# Altium project Interposer.PrjPcb
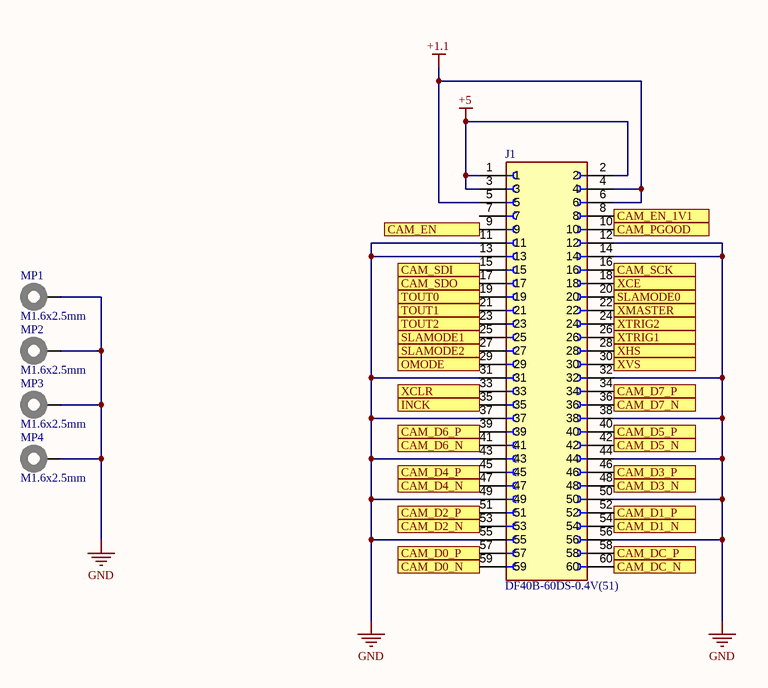
[diagram p0: CameraConn.SchDoc]
5 sheets, 48 parts. Net scope: flat (ports and power ports of the same name join across sheets).
Board file: PCB_Right.PcbDoc
Sheets:
  CameraConn.SchDoc
  CameraSupplies.SchDoc
  DisplayConn.SchDoc
  DisplaySupplies.SchDoc
  MainboardConn.SchDoc

## Sheet CameraConn.SchDoc
size 431 x 279 mm; Organization: ORGANIZATION; Address1: ADDRESS 1; Address2: ADDRESS 2; Address3: ADDRESS 3; Address4: ADDRESS 4; Revision: -; SheetNumber: 1; SheetTotal: 5; ENG_APP_DATE: --/--/--; DSN_APP_DATE: --/--/--; CHK_APP_DATE: --/--/--

### Parts
J1  DF40B-60DS-0.4V(51)  [HRS_DF40B-60DS-0.4V(51)]
MP1  M1.6x2.5mm  [97730256330]
MP2  M1.6x2.5mm  [97730256330]
MP3  M1.6x2.5mm  [97730256330]
MP4  M1.6x2.5mm  [97730256330]

### Ports
CAM_D0_N, CAM_D0_P, CAM_D1_N, CAM_D1_P, CAM_D2_N, CAM_D2_P, CAM_D3_N, CAM_D3_P, CAM_D4_N, CAM_D4_P, CAM_D5_N, CAM_D5_P, CAM_D6_N, CAM_D6_P, CAM_D7_N, CAM_D7_P, CAM_DC_N, CAM_DC_P, CAM_EN, CAM_EN_1V1, CAM_PGOOD, CAM_SCK, CAM_SDI, CAM_SDO, INCK, OMODE, SLAMODE0, SLAMODE1, SLAMODE2, TOUT0, TOUT1, TOUT2, XCE, XCLR, XHS, XMASTER, XTRIG1, XTRIG2, XVS

### Nets
+1.1: J1.4 J1.5 J1.6
+5: J1.1 J1.2 J1.3
GND: J1.11 J1.12 J1.13 J1.14 J1.31 J1.32 J1.37 J1.38 J1.43 J1.44 J1.49 J1.50 J1.55 J1.56 MP1.1 MP2.1 MP3.1 MP4.1
CAM_D0_N: J1.59 ; port CAM_D0_N
CAM_D0_P: J1.57 ; port CAM_D0_P
CAM_D1_N: J1.54 ; port CAM_D1_N
CAM_D1_P: J1.52 ; port CAM_D1_P
CAM_D2_N: J1.53 ; port CAM_D2_N
CAM_D2_P: J1.51 ; port CAM_D2_P
CAM_D3_N: J1.48 ; port CAM_D3_N
CAM_D3_P: J1.46 ; port CAM_D3_P
CAM_D4_N: J1.47 ; port CAM_D4_N
CAM_D4_P: J1.45 ; port CAM_D4_P
CAM_D5_N: J1.42 ; port CAM_D5_N
CAM_D5_P: J1.40 ; port CAM_D5_P
CAM_D6_N: J1.41 ; port CAM_D6_N
CAM_D6_P: J1.39 ; port CAM_D6_P
CAM_D7_N: J1.36 ; port CAM_D7_N
CAM_D7_P: J1.34 ; port CAM_D7_P
CAM_DC_N: J1.60 ; port CAM_DC_N
CAM_DC_P: J1.58 ; port CAM_DC_P
CAM_EN: J1.9 ; port CAM_EN
CAM_EN_1V1: J1.8 ; port CAM_EN_1V1
CAM_PGOOD: J1.10 ; port CAM_PGOOD
CAM_SCK: J1.16 ; port CAM_SCK
CAM_SDI: J1.15 ; port CAM_SDI
CAM_SDO: J1.17 ; port CAM_SDO
INCK: J1.35 ; port INCK
OMODE: J1.29 ; port OMODE
SLAMODE0: J1.20 ; port SLAMODE0
SLAMODE1: J1.25 ; port SLAMODE1
SLAMODE2: J1.27 ; port SLAMODE2
TOUT0: J1.19 ; port TOUT0
TOUT1: J1.21 ; port TOUT1
TOUT2: J1.23 ; port TOUT2
XCE: J1.18 ; port XCE
XCLR: J1.33 ; port XCLR
XHS: J1.28 ; port XHS
XMASTER: J1.22 ; port XMASTER
XTRIG1: J1.26 ; port XTRIG1
XTRIG2: J1.24 ; port XTRIG2
XVS: J1.30 ; port XVS

Not connected (* = marked no-connect by the designer): J1 7

### Notes on the sheet
- DWG. NO.
- REV.
- SHT.
- REVISION
- DESCRIPTION
- DATE
- APPROVED
- ENG:
- APPROVALS
- PROJECT
- DSN:
- CHK:
- REFERENCE DOCUMENTS
- PROJECT REVISION:
- TITLE
- SimulaVR
- DOCUMENT REVISION:
- DESIGN ITEM:
- BOM:
- FAB DWG:
- PCB DWG:
- ASSY DWG:
- SCALE:
- SIZE
- B
- CAGE CODE
- FILE NAME
- DWG NO.
- SHEET
- OF
- REV

### Library data of the parts
J1 = CMP-013-000000-1: MF: {'manufacturer': u'Hirose Electric Co Ltd'}; Availability: Unavailable; Package: None; Price: None; Source: DF40B-60DS-0.4V(51).SchLib; Value: *; Design Item ID: DF40B-60DS-0.4V(51); MP: DF40B-60DS-0.4V(51)
MP1-MP4 = 97730256330: WA-SMSI SMT Steel Spacer, internal Thread Bottom closed, OD 3.3mm, M1.6x2.5mm; Manufacturer: Wurth Elektronik; Inner Thread Length: 1.5mm; Surface: Tin; Thread: M1.6; ComponentLink1Description: Manufacturer; ComponentLink1URL: http://www.we-online.de; ComponentLink2Description: Datasheet; ComponentLink2URL: https://www.we-online.com/catalog/datasheet/97730256330.pdf; Mounting Technology: SMT; Packaging: Bulk; Manufacturer Part Number: 97730256330; Inner Diameter: -; Length: 2.5mm; Operating Temperature: -55 to +150degC; Outer Diameter: 3.3mm; Published Date: April 2020; Material: Steel

## Sheet CameraSupplies.SchDoc
size 431 x 279 mm; Organization: ORGANIZATION; Address1: ADDRESS 1; Address2: ADDRESS 2; Address3: ADDRESS 3; Address4: ADDRESS 4; Revision: -; SheetNumber: 2; SheetTotal: 5; ENG_APP_DATE: --/--/--; DSN_APP_DATE: --/--/--; CHK_APP_DATE: --/--/--
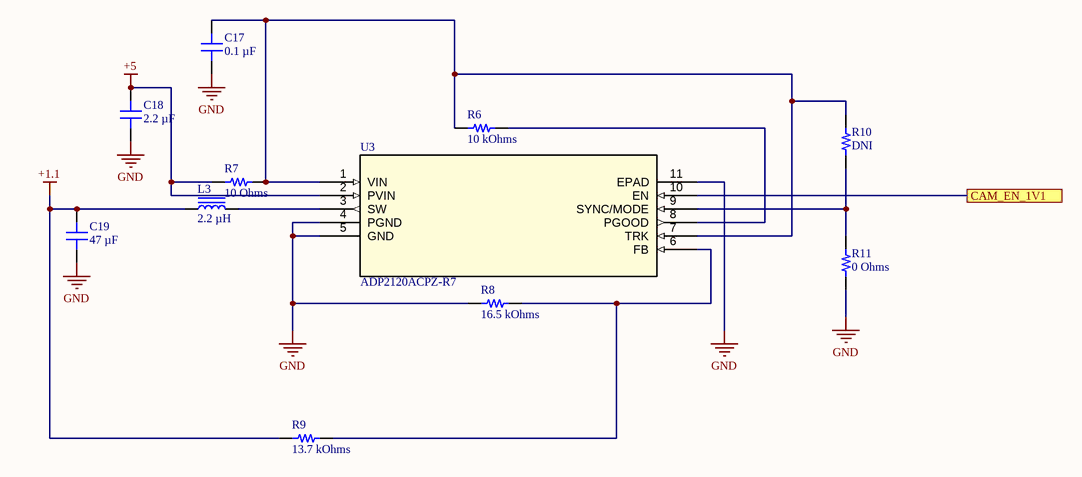
[diagram p1: CameraSupplies.SchDoc]

### Parts
C17  0.1 µF  [CAP 0201_0603]
C18  2.2 µF  [CAP 0402_1005]
C19  47 µF  [CAP 0603_1608]
L3  2.2 µH  [IND 0806_2016]
R6  10 kOhms  [RES 0201_0603]
R7  10 Ohms  [RES 0201_0603]
R8  16.5 kOhms  [RES 0201_0603]
R9  13.7 kOhms  [RES 0201_0603]
R10  DNI  [RES 0402_1005]
R11  0 Ohms  [RES 0402_1005]
U3  ADP2120ACPZ-R7  [CP_10_9_ADI]

### Ports
CAM_EN_1V1

### Nets
+1.1: C19.2 L3.1 R9.1
+5: C18.2 R7.1 U3.2(PVIN)
GND: C17.1 C18.1 C19.1 R8.1 R11.2 U3.4(PGND) U3.5(GND) U3.11(EPAD)
CAM_EN_1V1: U3.10(EN) ; port CAM_EN_1V1
NetC17_2: C17.2 R6.1 R7.2 R10.1 U3.1(VIN) U3.7(TRK)
NetL3_2: L3.2 U3.3(SW)
NetR6_2: R6.2 U3.8(PGOOD)
NetR8_2: R8.2 R9.2 U3.6(FB)
NetR10_2: R10.2 R11.1 U3.9(SYNC/MODE)

### Notes on the sheet
- DWG. NO.
- REV.
- SHT.
- REVISION
- DESCRIPTION
- DATE
- APPROVED
- ENG:
- APPROVALS
- PROJECT
- DSN:
- CHK:
- REFERENCE DOCUMENTS
- PROJECT REVISION:
- TITLE
- SimulaVR
- DOCUMENT REVISION:
- DESIGN ITEM:
- BOM:
- FAB DWG:
- PCB DWG:
- ASSY DWG:
- SCALE:
- SIZE
- B
- CAGE CODE
- FILE NAME
- DWG NO.
- SHEET
- OF
- REV

### Library data of the parts
C17 = GRM033R61A104KE15D: CAP CER 0.1UF 10V X5R 0201; manufacturer: Murata Electronics; Tolerance: ±10%; Part Number: GRM033R61A104KE15D; Value: 0.1 µF; Applications: General Purpose; Capacitance: 0.1 µF; componentlink1description: Datasheet; componentlink1url: https://www.murata.com/~/media/webrenewal/support/library/catalog/products/capacitor/mlcc/c02e.ashx?la=en-us; componentlink2description: DigiKey Link; componentlink2url: https://www.digikey.com/en/products/detail/murata-electronics/GRM033R61A104KE15D/2269163; Device Package: 0201 (0603 Metric); lastupdated: 2022-04-12 22:01:55; Lifecycle Status: Active; Minimum Order: 1; Mounting Type: Surface Mount, MLCC; Operating Temperature: -55°C ~ 85°C; Package / Case: 0201 (0603 Metric); packaging: CutTape; partid: 1641; Part Status: Active; price: 0.01; series: GRM; Size / Dimension: 0.024" L x 0.012" W (0.60mm x 0.30mm); Supplier 1: DigiKey; Supplier Part Number 1: 490-5881-1-ND; Temperature Coefficient: X5R; Thickness (Max): 0.013" (0.33mm); Voltage - Rated: 10V
C18 = GRM155R61C225ME44D: CAP CER 2.2UF 16V X5R 0402; manufacturer: Murata Electronics; Tolerance: ±20%; Part Number: GRM155R61C225ME44D; Value: 2.2 µF; Applications: General Purpose; Capacitance: 2.2 µF; componentlink1description: Datasheet; componentlink1url: https://search.murata.co.jp/Ceramy/image/img/A01X/G101/ENG/GRM155R61C225ME44-01.pdf; componentlink2description: DigiKey Link; componentlink2url: https://www.digikey.com/en/products/detail/murata-electronics/GRM155R61C225ME44D/5027541; Device Package: 0402 (1005 Metric); lastupdated: 2022-04-02 05:51:52; Lifecycle Status: Active; Minimum Order: 1; Mounting Type: Surface Mount, MLCC; Operating Temperature: -55°C ~ 85°C; Package / Case: 0402 (1005 Metric); packaging: TapeAndReel; partid: 4092; Part Status: Active; price: 0.03; series: GRM; Size / Dimension: 0.039" L x 0.020" W (1.00mm x 0.50mm); Supplier 1: DigiKey; Supplier Part Number 1: 490-10456-1-ND; Temperature Coefficient: X5R; Thickness (Max): 0.024" (0.60mm); Voltage - Rated: 16V
C19 = GRM188R60J476ME01D: CAP CER 47UF 6.3V X5R 0603; manufacturer: Murata Electronics; Tolerance: ±20%; Part Number: GRM188R60J476ME01D; Value: 47 µF; Applications: General Purpose; Capacitance: 47 µF; componentlink2description: DigiKey Link; componentlink2url: https://www.digikey.com/en/products/detail/murata-electronics/GRM188R60J476ME01D/13996874; Device Package: 0603 (1608 Metric); lastupdated: 5/20/2022 2:38:45 PM; Lifecycle Status: Active; Minimum Order: 1; Mounting Type: Surface Mount, MLCC; Operating Temperature: -55°C ~ 85°C; Package / Case: 0603 (1608 Metric); packaging: TapeAndReel; partid: 44498; Part Status: Active; price: 0.10; series: GRM; Size / Dimension: 0.063" L x 0.031" W (1.60mm x 0.80mm); Supplier 1: DigiKey; Supplier Part Number 1: 490-GRM188R60J476ME01DCT-ND; Temperature Coefficient: X5R; Thickness (Max): 0.039" (1.00mm); Voltage - Rated: 6.3V
L3 = 74479276222C: FIXED IND 2.2UH 1.6A 135MOHM SMD; Manufacturer: Würth Elektronik; Current - Saturation: 2.5A; DC Resistance (DCR): 135mOhm Max; Frequency - Self Resonant: 40MHz; Inductance Frequency - Test: 1 MHz; Material - Core: 0806 (2016 Metric); Shielding: Shielded; Tolerance: ±20%; Type: Molded; Part Number: 74479276222C; ComponentLink1Description: Datasheet; ComponentLink1URL: https://katalog.we-online.de/pbs/datasheet/74479276222C.pdf; ComponentLink2Description: DigiKey Link; ComponentLink2URL: https://www.digikey.com/en/products/detail/würth-elektronik/74479276222C/5870522; Current Rating (Amps): 1.6 A; Device Package: 0806 (2016 Metric); Height - Seated (Max): 0.039" (1.00mm); Inductance: 2.2 µH; LastUpdated: 5/23/2022 1:46:32 PM; Lifecycle Status: Active; Minimum Order: 1; Mounting Type: Surface Mount; Operating Temperature: -40°C ~ 125°C; Package / Case: 0806 (2016 Metric); Packaging: TapeAndReel; PartId: 2839; Part Status: Active; Price: 0.51; Series: WE-PMCI; Size / Dimension: 0.079" L x 0.063" W (2.00mm x 1.60mm); Supplier 1: DigiKey; Supplier Part Number 1: 732-9716-1-ND; Value: 2.2 µH
R6 = CRCW020110K0FKED: RES SMD 10K OHM 1% 1/20W 0201; Manufacturer: Vishay Dale; Power (Watts): 0.05W, 1/20W; Temperature Coefficient: ±100ppm/°C; Part Number: CRCW020110K0FKED; Value: 10 kOhms; ComponentLink1Description: Datasheet; ComponentLink1URL: http://www.vishay.com/docs/20052/crcw0201e3.pdf; ComponentLink2Description: DigiKey Link; ComponentLink2URL: https://www.digikey.com/en/products/detail/vishay-dale/CRCW020110K0FKED/1967989; Composition: Thick Film; Device Package: 0201 (0603 Metric); Height - Seated (Max): 0.010" (0.26mm); LastUpdated: 5/23/2022 1:02:37 PM; Lifecycle Status: Active; Minimum Order: 1; Number of Terminations: 2; Operating Temperature: -55°C ~ 155°C; Package / Case: 0201 (0603 Metric); Packaging: TapeAndReel; PartId: 29; Part Status: Active; Price: 0.03; Resistance: 10 kOhms; Series: CRCW; Size / Dimension: 0.024" L x 0.012" W (0.60mm x 0.30mm); Supplier 1: DigiKey; Supplier Part Number 1: 541-10.0KAABCT-ND; Supplier Device Package: 0201; Tolerance: ±1%
R7 = CRG0201F10R: RES SMD 10 OHM 1% 1/20W 0201; Manufacturer: TE Connectivity Passive Product; Power (Watts): 0.05W, 1/20W; Temperature Coefficient: ±400ppm/°C; Part Number: CRG0201F10R; Value: 10 Ohms; ComponentLink1Description: Datasheet; ComponentLink1URL: https://www.te.com/commerce/DocumentDelivery/DDEController?Action=srchrtrv&DocNm=1773204&DocType=DS&DocLang=English; ComponentLink2Description: DigiKey Link; ComponentLink2URL: https://www.digikey.com/en/products/detail/te-connectivity-passive-product/CRG0201F10R/4489648; Composition: Thick Film; Device Package: 0201 (0603 Metric); Height - Seated (Max): 0.010" (0.26mm); LastUpdated: 5/23/2022 1:02:37 PM; Lifecycle Status: Active; Minimum Order: 1; Number of Terminations: 2; Operating Temperature: -55°C ~ 155°C; Package / Case: 0201 (0603 Metric); Packaging: TapeAndReel; PartId: 3; Part Status: Active; Price: 0.03; Resistance: 10 Ohms; Series: CRG, Neohm; Size / Dimension: 0.024" L x 0.012" W (0.60mm x 0.30mm); Supplier 1: DigiKey; Supplier Part Number 1: A129573CT-ND; Supplier Device Package: 0201; Tolerance: ±1%
R8 = CRCW020116K5FNED: RES SMD 16.5K OHM 1% 1/20W 0201; Manufacturer: Vishay Dale; Power (Watts): 0.05W, 1/20W; Temperature Coefficient: ±200ppm/°C; Part Number: CRCW020116K5FNED; Value: 16.5 kOhms; ComponentLink1Description: Datasheet; ComponentLink1URL: http://www.vishay.com/docs/20052/crcw0201e3.pdf; ComponentLink2Description: DigiKey Link; ComponentLink2URL: https://www.digikey.com/en/products/detail/vishay-dale/CRCW020116K5FNED/1199935; Composition: Thick Film; Device Package: 0201 (0603 Metric); Height - Seated (Max): 0.011" (0.28mm); LastUpdated: 5/23/2022 1:02:31 PM; Lifecycle Status: Active; Minimum Order: 1; Number of Terminations: 2; Operating Temperature: -55°C ~ 155°C; Package / Case: 0201 (0603 Metric); Packaging: TapeAndReel; PartId: 1208; Part Status: Active; Price: 0.01; Resistance: 16.5 kOhms; Series: CRCW; Size / Dimension: 0.024" L x 0.012" W (0.60mm x 0.30mm); Supplier 1: DigiKey; Supplier Part Number 1: 541-CRCW020116K5FNEDCT-ND; Supplier Device Package: 0201; Tolerance: ±1%
R9 = RK73H1HTTC1372F: RES 13.7K OHM 1% 1/20W 0201; Manufacturer: KOA Speer Electronics, Inc.; Power (Watts): 0.05W, 1/20W; Temperature Coefficient: ±200ppm/°C; Part Number: RK73H1HTTC1372F; Value: 13.7 kOhms; ComponentLink1Description: Datasheet; ComponentLink1URL: http://www.koaspeer.com/catimages/Products/RK73H/RK73H.pdf; ComponentLink2Description: DigiKey Link; ComponentLink2URL: https://www.digikey.com/en/products/detail/koa-speer-electronics-inc/RK73H1HTTC1372F/9843939; Composition: Thick Film; Device Package: 0201 (0603 Metric); Features: Automotive AEC-Q200, Moisture Resistant; Height - Seated (Max): 0.010" (0.26mm); LastUpdated: 5/23/2022 1:02:37 PM; Lifecycle Status: Active; Minimum Order: 1; Number of Terminations: 2; Operating Temperature: -55°C ~ 155°C; Package / Case: 0201 (0603 Metric); Packaging: CutTape; PartId: 168; Part Status: Active; Price: 0.01; Ratings: AEC-Q200; Resistance: 13.7 kOhms; Series: RK73H; Size / Dimension: 0.024" L x 0.012" W (0.60mm x 0.30mm); Supplier 1: DigiKey; Supplier Part Number 1: 2019-RK73H1HTTC1372FCT-ND; Supplier Device Package: 0201; Tolerance: ±1%
R10 = CRCW04020000Z0EDHP: RES SMD 0 OHM JUMPER 1/5W 0402; Manufacturer: Vishay Dale; Power (Watts): 0.2W, 1/5W; Resistance: 0 Ohms; Part Number: CRCW04020000Z0EDHP; Value: DNI; ComponentLink1Description: Datasheet; ComponentLink1URL: http://www.vishay.com/docs/20043/crcwhpe3.pdf; ComponentLink2Description: DigiKey Link; ComponentLink2URL: http://digikey.com/product-detail/en/vishay-dale/CRCW04020000Z0EDHP/541-0.0YBCT-ND/2223008; Composition: Thick Film; Device Package: 0402 (1005 Metric); Features: Automotive AEC-Q200, Pulse Withstanding; Height - Seated (Max): 0.016" (0.40mm); LastUpdated: 2022-04-02 06:08:09; Lifecycle Status: Active; Minimum Order: 1; Number of Terminations: 2; Operating Temperature: -55°C ~ 155°C; Package / Case: 0402 (1005 Metric); Packaging: TapeAndReel; PartId: 3131; Part Status: Active; Price: 0.01; Ratings: AEC-Q200; Series: CRCW-HP; Size / Dimension: 0.039" L x 0.020" W (1.00mm x 0.50mm); Supplier 1: DigiKey; Supplier Part Number 1: 541-0.0YBCT-ND; Supplier Device Package: 0402; Tolerance: Jumper
R11 = CRCW04020000Z0EDHP: RES SMD 0 OHM JUMPER 1/5W 0402; Manufacturer: Vishay Dale; Power (Watts): 0.2W, 1/5W; Part Number: CRCW04020000Z0EDHP; Value: 0 Ohms; ComponentLink1Description: Datasheet; ComponentLink1URL: http://www.vishay.com/docs/20043/crcwhpe3.pdf; ComponentLink2Description: DigiKey Link; ComponentLink2URL: http://digikey.com/product-detail/en/vishay-dale/CRCW04020000Z0EDHP/541-0.0YBCT-ND/2223008; Composition: Thick Film; Device Package: 0402 (1005 Metric); Features: Automotive AEC-Q200, Pulse Withstanding; Height - Seated (Max): 0.016" (0.40mm); LastUpdated: 2022-04-02 06:08:09; Lifecycle Status: Active; Minimum Order: 1; Number of Terminations: 2; Operating Temperature: -55°C ~ 155°C; Package / Case: 0402 (1005 Metric); Packaging: TapeAndReel; PartId: 3131; Part Status: Active; Price: 0.01; Ratings: AEC-Q200; Resistance: 0 Ohms; Series: CRCW-HP; Size / Dimension: 0.039" L x 0.020" W (1.00mm x 0.50mm); Supplier 1: DigiKey; Supplier Part Number 1: 541-0.0YBCT-ND; Supplier Device Package: 0402; Tolerance: Jumper
U3 = CMP-011-000001-1: No Description Available; Mfr_Name: Analog Devices Inc; Source: ADP2120ACPZ-R7.SchLib; Design Item ID: ADP2120ACPZ-R7; RefDes: RefDes; Copyright: Copyright (C) 2022 Ultra Librarian. All rights reserved.; Manufacturer_Part_Number: ADP2120ACPZ-R7; Type: DEV

## Sheet DisplayConn.SchDoc
size 431 x 279 mm; Organization: ORGANIZATION; Address1: ADDRESS 1; Address2: ADDRESS 2; Address3: ADDRESS 3; Address4: ADDRESS 4; Revision: -; SheetNumber: 3; SheetTotal: 5; ENG_APP_DATE: --/--/--; DSN_APP_DATE: --/--/--; CHK_APP_DATE: --/--/--
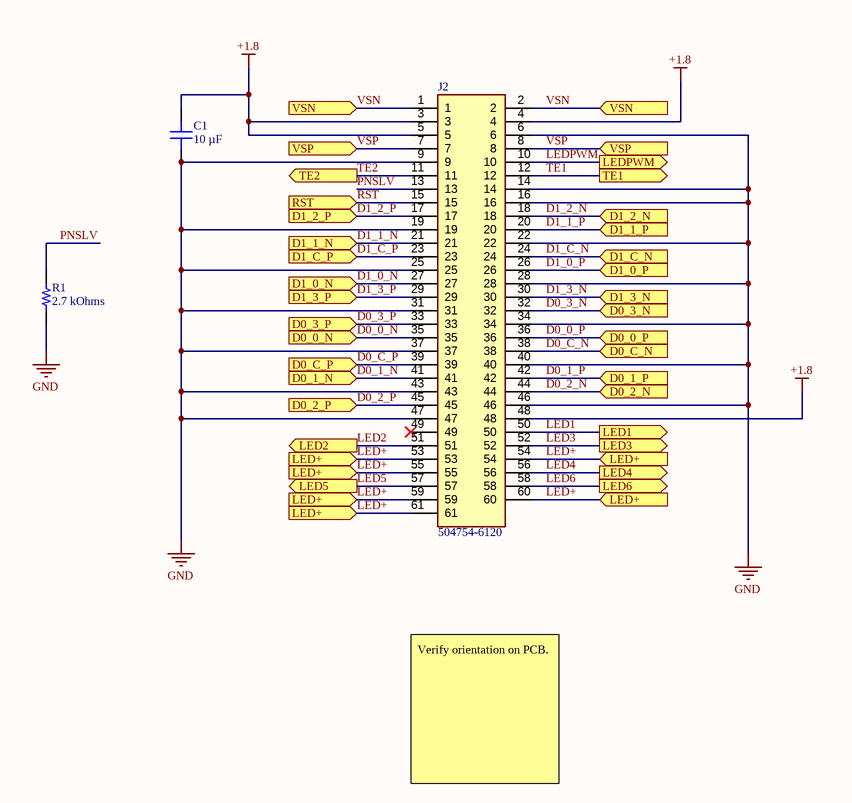
[diagram p2: DisplayConn.SchDoc]

### Parts
C1  10 µF  [CAP 0603_1608]
J2  504754-6120  [5047546120]
R1  2.7 kOhms  [RES 0201_0603]

### Ports
D0_0_N (in), D0_0_P (in), D0_1_N (in), D0_1_P (in), D0_2_N (in), D0_2_P (in), D0_3_N (in), D0_3_P (in), D0_C_N (in), D0_C_P (in), D1_0_N (in), D1_0_P (in), D1_1_N (in), D1_1_P (in), D1_2_N (in), D1_2_P (in), D1_3_N (in), D1_3_P (in), D1_C_N (in), D1_C_P (in), LED1 (out), LED2 (out), LED3 (out), LED4 (out), LED5 (out), LED6 (out), LED+ (in), LEDPWM (out), RST (in), TE1 (out), TE2 (out), VSN (in), VSP (in)

### Nets
+1.8: C1.2 J2.3 J2.4 J2.5 J2.48
GND: C1.1 J2.6 J2.9 J2.14 J2.16 J2.19 J2.22 J2.25 J2.28 J2.31 J2.34 J2.37 J2.40 J2.43 J2.46 J2.47 R1.1
D0_0_N: J2.35 ; port D0_0_N
D0_0_P: J2.36 ; port D0_0_P
D0_1_N: J2.41 ; port D0_1_N
D0_1_P: J2.42 ; port D0_1_P
D0_2_N: J2.44 ; port D0_2_N
D0_2_P: J2.45 ; port D0_2_P
D0_3_N: J2.32 ; port D0_3_N
D0_3_P: J2.33 ; port D0_3_P
D0_C_N: J2.38 ; port D0_C_N
D0_C_P: J2.39 ; port D0_C_P
D1_0_N: J2.27 ; port D1_0_N
D1_0_P: J2.26 ; port D1_0_P
D1_1_N: J2.21 ; port D1_1_N
D1_1_P: J2.20 ; port D1_1_P
D1_2_N: J2.18 ; port D1_2_N
D1_2_P: J2.17 ; port D1_2_P
D1_3_N: J2.30 ; port D1_3_N
D1_3_P: J2.29 ; port D1_3_P
D1_C_N: J2.24 ; port D1_C_N
D1_C_P: J2.23 ; port D1_C_P
LED1: J2.50 ; port LED1
LED2: J2.51 ; port LED2
LED3: J2.52 ; port LED3
LED4: J2.56 ; port LED4
LED5: J2.57 ; port LED5
LED6: J2.58 ; port LED6
LED+: J2.53 J2.54 J2.55 J2.59 J2.60 J2.61 ; port LED+
LEDPWM: J2.10 ; port LEDPWM
PNSLV: J2.13 R1.2
RST: J2.15 ; port RST
TE1: J2.12 ; port TE1
TE2: J2.11 ; port TE2
VSN: J2.1 J2.2 ; port VSN
VSP: J2.7 J2.8 ; port VSP

Not connected (* = marked no-connect by the designer): J2 49*

### Notes on the sheet
- Verify orientation on PCB.
- DWG. NO.
- REV.
- SHT.
- REVISION
- DESCRIPTION
- DATE
- APPROVED
- ENG:
- APPROVALS
- PROJECT
- DSN:
- CHK:
- REFERENCE DOCUMENTS
- PROJECT REVISION:
- TITLE
- SimulaVR
- DOCUMENT REVISION:
- DESIGN ITEM:
- BOM:
- FAB DWG:
- PCB DWG:
- ASSY DWG:
- SCALE:
- SIZE
- B
- CAGE CODE
- FILE NAME
- DWG NO.
- SHEET
- OF
- REV

### Library data of the parts
C1 = GRM188R61C106MA73D: CAP CER 10UF 16V X5R 0603; manufacturer: Murata Electronics; Tolerance: ±20%; Part Number: GRM188R61C106MA73D; Value: 10 µF; Applications: General Purpose; Capacitance: 10 µF; componentlink1description: Datasheet; componentlink1url: https://www.murata.com/~/media/webrenewal/support/library/catalog/products/capacitor/mlcc/c02e.ashx?la=en-us; componentlink2description: DigiKey Link; componentlink2url: https://www.digikey.com/en/products/detail/murata-electronics/GRM188R61C106MA73D/3900480; Device Package: 0603 (1608 Metric); lastupdated: 2022-04-02 05:55:00; Lifecycle Status: Active; Minimum Order: 1; Mounting Type: Surface Mount, MLCC; Operating Temperature: -55°C ~ 85°C; Package / Case: 0603 (1608 Metric); packaging: TapeAndReel; partid: 15141; Part Status: Active; price: 0.04; series: GRM; Size / Dimension: 0.063" L x 0.031" W (1.60mm x 0.80mm); Supplier 1: DigiKey; Supplier Part Number 1: 490-7201-1-ND; Temperature Coefficient: X5R; Thickness (Max): 0.039" (1.00mm); Voltage - Rated: 16V
J2 = 504754-6120: Connector; Manufacturer_Name: Molex; Datasheet Link: https://componentsearchengine.com/Datasheets/1/504754-6120.pdf; Height: 1.67mm; Manufacturer_Part_Number: 504754-6120; Mouser Part Number: 538-504754-6120; Mouser Price/Stock: https://www.mouser.com/Search/Refine.aspx?Keyword=538-504754-6120
R1 = ERJ-U01J272C: RES 2.7K OHM 5% 1/20W 0201 SMD; Manufacturer: Panasonic Electronic Components; Power (Watts): 0.05W, 1/20W; Temperature Coefficient: ±200ppm/°C; Part Number: ERJ-U01J272C; Value: 2.7 kOhms; ComponentLink1Description: Datasheet; ComponentLink1URL: https://industrial.panasonic.com/cdbs/www-data/pdf/RDP0000/AOA0000C334.pdf; ComponentLink2Description: DigiKey Link; ComponentLink2URL: https://www.digikey.com/en/products/detail/panasonic-electronic-components/ERJ-U01J272C/11641374; Composition: Thick Film; Device Package: 0201 (0603 Metric); Features: Anti-Sulfur; Height - Seated (Max): 0.010" (0.26mm); LastUpdated: 2022-04-12 22:15:26; Lifecycle Status: Active; Minimum Order: 1; Number of Terminations: 2; Operating Temperature: -55°C ~ 125°C; Package / Case: 0201 (0603 Metric); Packaging: TapeAndReel; PartId: 64645; Part Status: Active; Price: 0.04; Resistance: 2.7 kOhms; Series: ERJ-U01; Size / Dimension: 0.024" L x 0.012" W (0.60mm x 0.30mm); Supplier 1: DigiKey; Supplier Part Number 1: 10-ERJ-U01J272CCT-ND; Supplier Device Package: 0201; Tolerance: ±5%

## Sheet DisplaySupplies.SchDoc
size 431 x 279 mm; Organization: ORGANIZATION; Address1: ADDRESS 1; Address2: ADDRESS 2; Address3: ADDRESS 3; Address4: ADDRESS 4; Revision: -; SheetNumber: 4; SheetTotal: 5; ENG_APP_DATE: --/--/--; DSN_APP_DATE: --/--/--; CHK_APP_DATE: --/--/--
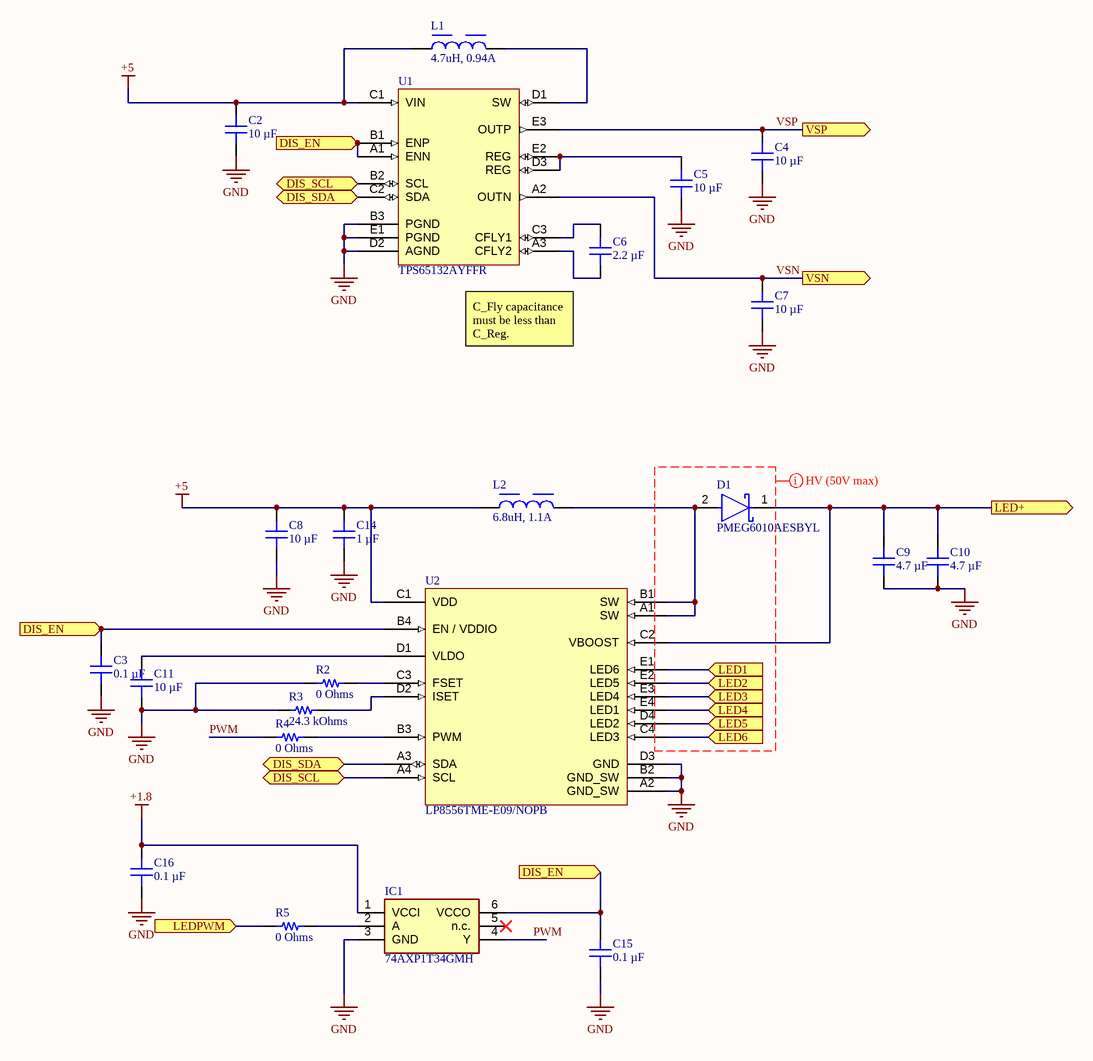
[diagram p3: DisplaySupplies.SchDoc]

### Parts
C2  10 µF  [CAP 0603_1608]
C3  0.1 µF  [CAP 0201_0603]
C4  10 µF  [CAP 0603_1608]
C5  10 µF  [CAP 0603_1608]
C6  2.2 µF  [CAP 0402_1005]
C7  10 µF  [CAP 0603_1608]
C8  10 µF  [CAP 0603_1608]
C9  4.7 µF  [CAP 1206_3216 - 0.8MM]
C10  4.7 µF  [CAP 1206_3216 - 0.8MM]
C11  10 µF  [CAP 0603_1608]
C14  1 µF  [CAP 0402_1005]
C15  0.1 µF  [CAP 0201_0603]
C16  0.1 µF  [CAP 0201_0603]
D1  PMEG6010AESBYL  [FP-SOD993-MFG]
IC1  74AXP1T34GMH  [PESD3V3L5UF115]
L1  4.7uH, 0.94A  [WE-MAPI_2510]
L2  6.8uH, 1.1A  [WE-MAPI_3015]
R2  0 Ohms  [RES 0402_1005]
R3  24.3 kOhms  [RES 0402_1005]
R4  0 Ohms  [RES 0402_1005]
R5  0 Ohms  [RES 0402_1005]
U1  TPS65132AYFFR  [BGA15C40P3X5_151X211X62]
U2  LP8556TME-E09/NOPB  [BGA20C40P4X5_171X237X68]

### Ports
DIS_EN (in), DIS_SCL (bidir), DIS_SDA (bidir), LED1 (in), LED2 (in), LED3 (in), LED4 (in), LED5 (in), LED6 (in), LED+ (out), LEDPWM (in), VSN (out), VSP (out)

### Nets
+1.8: C16.2 IC1.1(VCCI)
+5: C2.2 C8.2 C14.2 L1.1 L2.1 U1.C1(VIN) U2.C1(VDD)
GND: C2.1 C3.1 C4.1 C5.1 C7.1 C8.1 C9.1 C10.1 C11.1 C14.1 C15.1 C16.1 IC1.3(GND) R2.2 R3.2 U1.B3(PGND) U1.D2(AGND) U1.E1(PGND) U2.A2(GND_SW) U2.B2(GND_SW) U2.D3(GND)
DIS_EN: C3.2 C15.2 IC1.6(VCCO) U1.A1(ENN) U1.B1(ENP) U2.B4(EN_/_VDDIO) ; port DIS_EN
DIS_SCL: U1.B2(SCL) U2.A4(SCL) ; port DIS_SCL
DIS_SDA: U1.C2(SDA) U2.A3(SDA) ; port DIS_SDA
LED1: U2.E1(LED6) ; port LED1
LED2: U2.E2(LED5) ; port LED2
LED3: U2.E3(LED4) ; port LED3
LED4: U2.E4(LED1) ; port LED4
LED5: U2.D4(LED2) ; port LED5
LED6: U2.C4(LED3) ; port LED6
LED+: C9.2 C10.2 D1.1(K) U2.C2(VBOOST) ; port LED+
LEDPWM: R5.2 ; port LEDPWM
PWM: IC1.4(Y) R4.2
VSN: C7.2 U1.A2(OUTN) ; port VSN
VSP: C4.2 U1.E3(OUTP) ; port VSP
NetC5_2: C5.2 U1.D3(REG) U1.E2(REG)
NetC6_1: C6.1 U1.A3(CFLY2)
NetC6_2: C6.2 U1.C3(CFLY1)
NetC11_2: C11.2 U2.D1(VLDO)
NetD1_2: D1.2(A) L2.2 U2.A1(SW) U2.B1(SW)
NetIC1_2: IC1.2(A) R5.1
NetL1_2: L1.2 U1.D1(SW)
NetR2_1: R2.1 U2.C3(FSET)
NetR3_1: R3.1 U2.D2(ISET)
NetR4_1: R4.1 U2.B3(PWM)

Not connected (* = marked no-connect by the designer): IC1 5(n.c.)*

### Layout directives
net class HV: (no net found under the mark)

### Notes on the sheet
- C_Fly capacitance must be less than C_Reg.
- DWG. NO.
- REV.
- SHT.
- REVISION
- DESCRIPTION
- DATE
- APPROVED
- ENG:
- APPROVALS
- PROJECT
- DSN:
- CHK:
- REFERENCE DOCUMENTS
- PROJECT REVISION:
- TITLE
- SimulaVR
- DOCUMENT REVISION:
- DESIGN ITEM:
- BOM:
- FAB DWG:
- PCB DWG:
- ASSY DWG:
- SCALE:
- SIZE
- B
- CAGE CODE
- FILE NAME
- DWG NO.
- SHEET
- OF
- REV

### Library data of the parts
C2 C4 C5 C7 C8 C11 = GRM188R61C106MA73D: as C1 on sheet DisplayConn; Part Number: GRM188R61C106MA73D; Value: 10 µF; Applications: General Purpose; Capacitance: 10 µF; componentlink1description: Datasheet; componentlink1url: https://www.murata.com/~/media/webrenewal/support/library/catalog/products/capacitor/mlcc/c02e.ashx?la=en-us; componentlink2description: DigiKey Link; componentlink2url: https://www.digikey.com/en/products/detail/murata-electronics/GRM188R61C106MA73D/3900480; Device Package: 0603 (1608 Metric); lastupdated: 2022-04-02 05:55:00; Lifecycle Status: Active; Minimum Order: 1; Mounting Type: Surface Mount, MLCC; Operating Temperature: -55°C ~ 85°C; Package / Case: 0603 (1608 Metric); packaging: TapeAndReel; partid: 15141; Part Status: Active; price: 0.04; series: GRM; Size / Dimension: 0.063" L x 0.031" W (1.60mm x 0.80mm); Supplier 1: DigiKey; Supplier Part Number 1: 490-7201-1-ND; Temperature Coefficient: X5R; Thickness (Max): 0.039" (1.00mm); Voltage - Rated: 16V
C3 C15 C16 = GRM033R61A104KE15D: as C17 on sheet CameraSupplies; Part Number: GRM033R61A104KE15D; Value: 0.1 µF; Applications: General Purpose; Capacitance: 0.1 µF; componentlink1description: Datasheet; componentlink1url: https://www.murata.com/~/media/webrenewal/support/library/catalog/products/capacitor/mlcc/c02e.ashx?la=en-us; componentlink2description: DigiKey Link; componentlink2url: https://www.digikey.com/en/products/detail/murata-electronics/GRM033R61A104KE15D/2269163; Device Package: 0201 (0603 Metric); lastupdated: 2022-04-12 22:01:55; Lifecycle Status: Active; Minimum Order: 1; Mounting Type: Surface Mount, MLCC; Operating Temperature: -55°C ~ 85°C; Package / Case: 0201 (0603 Metric); packaging: CutTape; partid: 1641; Part Status: Active; price: 0.01; series: GRM; Size / Dimension: 0.024" L x 0.012" W (0.60mm x 0.30mm); Supplier 1: DigiKey; Supplier Part Number 1: 490-5881-1-ND; Temperature Coefficient: X5R; Thickness (Max): 0.013" (0.33mm); Voltage - Rated: 10V
C6 = GRM155R61C225ME44D: as C18 on sheet CameraSupplies; Part Number: GRM155R61C225ME44D; Value: 2.2 µF; Applications: General Purpose; Capacitance: 2.2 µF; componentlink1description: Datasheet; componentlink1url: https://search.murata.co.jp/Ceramy/image/img/A01X/G101/ENG/GRM155R61C225ME44-01.pdf; componentlink2description: DigiKey Link; componentlink2url: https://www.digikey.com/en/products/detail/murata-electronics/GRM155R61C225ME44D/5027541; Device Package: 0402 (1005 Metric); lastupdated: 2022-04-02 05:51:52; Lifecycle Status: Active; Minimum Order: 1; Mounting Type: Surface Mount, MLCC; Operating Temperature: -55°C ~ 85°C; Package / Case: 0402 (1005 Metric); packaging: TapeAndReel; partid: 4092; Part Status: Active; price: 0.03; series: GRM; Size / Dimension: 0.039" L x 0.020" W (1.00mm x 0.50mm); Supplier 1: DigiKey; Supplier Part Number 1: 490-10456-1-ND; Temperature Coefficient: X5R; Thickness (Max): 0.024" (0.60mm); Voltage - Rated: 16V
C9 C10 = GRM31CR71H475KA12L: CAP CER 4.7UF 50V X7R 1206; manufacturer: Murata Electronics; Tolerance: ±10%; Part Number: GRM31CR71H475KA12L; Value: 4.7 µF; Applications: General Purpose; Capacitance: 4.7 µF; componentlink1description: Datasheet; componentlink1url: https://www.murata.com/~/media/webrenewal/support/library/catalog/products/capacitor/mlcc/c02e.ashx?la=en-us; componentlink2description: DigiKey Link; componentlink2url: https://www.digikey.com/en/products/detail/murata-electronics/GRM31CR71H475KA12L/2548209; Device Package: 1206 (3216 Metric); lastupdated: 2022-04-02 06:00:47; Lifecycle Status: Active; Minimum Order: 1; Mounting Type: Surface Mount, MLCC; Operating Temperature: -55°C ~ 125°C; Package / Case: 1206 (3216 Metric); packaging: TapeAndReel; partid: 20010; Part Status: Active; price: 0.08; series: GRM; Size / Dimension: 0.126" L x 0.063" W (3.20mm x 1.60mm); Supplier 1: DigiKey; Supplier Part Number 1: 490-6521-1-ND; Temperature Coefficient: X7R; Thickness (Max): 0.071" (1.80mm); Voltage - Rated: 50V
C14 = GRM155R61C105MA12D: CAP CER 1UF 16V X5R 0402; manufacturer: Murata Electronics; Tolerance: ±20%; Part Number: GRM155R61C105MA12D; Value: 1 µF; Applications: General Purpose; Capacitance: 1 µF; componentlink1description: Datasheet; componentlink1url: https://search.murata.co.jp/Ceramy/image/img/A01X/G101/ENG/GRM155R61C105MA12-01.pdf; componentlink2description: DigiKey Link; componentlink2url: https://www.digikey.com/en/products/detail/murata-electronics/GRM155R61C105MA12D/4905131; Device Package: 0402 (1005 Metric); lastupdated: 2022-04-02 05:51:33; Lifecycle Status: Active; Minimum Order: 1; Mounting Type: Surface Mount, MLCC; Operating Temperature: -55°C ~ 85°C; Package / Case: 0402 (1005 Metric); packaging: TapeAndReel; partid: 10295; Part Status: Active; price: 0.01; series: GRM; Size / Dimension: 0.039" L x 0.020" W (1.00mm x 0.50mm); Supplier 1: DigiKey; Supplier Part Number 1: 490-14599-1-ND; Temperature Coefficient: X5R; Thickness (Max): 0.022" (0.55mm); Voltage - Rated: 16V
D1 = CMP-14398-000012-1: DIODE SCHOTTKY 60V 1A DSN1006-2
IC1 = 74AXP1T34GMH: Integrated Circuit; Manufacturer_Name: Nexperia; Datasheet Link: https://assets.nexperia.com/documents/data-sheet/74AXP1T34.pdf; Height: 0.5mm; Manufacturer_Part_Number: 74AXP1T34GMH; Mouser Part Number: 771-74AXP1T34GMH; Mouser Price/Stock: https://www.mouser.co.uk/ProductDetail/Nexperia/74AXP1T34GMH?qs=64Y9EYqwa9hz4MxtKQGkpQ%3D%3D; Arrow Part Number: 74AXP1T34GMH; Arrow Price/Stock: https://www.arrow.com/en/products/74axp1t34gmh/nexperia
L1 = 74438323047: WE-MAPI SMT Power Inductor, size 2510, 4.7uH, 0.94A; Manufacturer: Wurth Elektronik; DC Resistance typ.: 338mOhm; DC Resistance max.: 388mOhm; Self Resonant Frequency: 35MHz; Saturation Current: 1.75A; ComponentLink1Description: Manufacturer; ComponentLink1URL: http://www.we-online.de; ComponentLink2Description: Datasheet; ComponentLink2URL: https://www.we-online.com/catalog/datasheet/74438323047.pdf; Mounting Technology: SMT; Operating Temperature: -40 to +125degC; Packaging: Tape and Reel; Size: 2510; Inductance: 4.7uH; Manufacturer Part Number: 74438323047; Rated Current: 0.94A; Height: 1mm; Length: 2.5mm; Width: 2mm
L2 = 74438335068: WE-MAPI SMT Power Inductor, size 3015, 6.8uH, 1.1A; Manufacturer: Wurth Elektronik; DC Resistance typ.: 250mOhm; DC Resistance max.: 287mOhm; Self Resonant Frequency: 25MHz; Saturation Current: 2.4A; ComponentLink1Description: Manufacturer; ComponentLink1URL: http://www.we-online.de; ComponentLink2Description: Datasheet; ComponentLink2URL: https://www.we-online.com/catalog/datasheet/74438335068.pdf; Mounting Technology: SMT; Operating Temperature: -40 to +125degC; Packaging: Tape and Reel; Size: 3015; Inductance: 6.8uH; Manufacturer Part Number: 74438335068; Rated Current: 1.1A; Height: 1.5mm; Length: 3mm; Width: 3mm
R2 R4 R5 = CRCW04020000Z0EDHP: as R11 on sheet CameraSupplies; Part Number: CRCW04020000Z0EDHP; Value: 0 Ohms; ComponentLink1Description: Datasheet; ComponentLink1URL: http://www.vishay.com/docs/20043/crcwhpe3.pdf; ComponentLink2Description: DigiKey Link; ComponentLink2URL: http://digikey.com/product-detail/en/vishay-dale/CRCW04020000Z0EDHP/541-0.0YBCT-ND/2223008; Composition: Thick Film; Device Package: 0402 (1005 Metric); Features: Automotive AEC-Q200, Pulse Withstanding; Height - Seated (Max): 0.016" (0.40mm); LastUpdated: 2022-04-02 06:08:09; Lifecycle Status: Active; Minimum Order: 1; Number of Terminations: 2; Operating Temperature: -55°C ~ 155°C; Package / Case: 0402 (1005 Metric); Packaging: TapeAndReel; PartId: 3131; Part Status: Active; Price: 0.01; Ratings: AEC-Q200; Resistance: 0 Ohms; Series: CRCW-HP; Size / Dimension: 0.039" L x 0.020" W (1.00mm x 0.50mm); Supplier 1: DigiKey; Supplier Part Number 1: 541-0.0YBCT-ND; Supplier Device Package: 0402; Tolerance: Jumper
R3 = RC0402FR-0724K3L: RES 24.3K OHM 1% 1/16W 0402; Manufacturer: Yageo; Power (Watts): 0.063W, 1/16W; Temperature Coefficient: ±100ppm/°C; Part Number: RC0402FR-0724K3L; Value: 24.3 kOhms; ComponentLink1Description: Datasheet; ComponentLink1URL: https://www.yageo.com/upload/media/product/productsearch/datasheet/rchip/PYu-RC_Group_51_RoHS_L_10.pdf; ComponentLink2Description: DigiKey Link; ComponentLink2URL: https://www.digikey.com/en/products/detail/yageo/RC0402FR-0724K3L/5280931; Composition: Thick Film; Device Package: 0402 (1005 Metric); Features: Moisture Resistant; Height - Seated (Max): 0.016" (0.40mm); LastUpdated: 2022-04-02 06:08:10; Lifecycle Status: Active; Minimum Order: 1; Number of Terminations: 2; Operating Temperature: -55°C ~ 155°C; Package / Case: 0402 (1005 Metric); Packaging: CutTape; PartId: 2738; Part Status: Active; Price: 0.01; Resistance: 24.3 kOhms; Series: RC_L; Size / Dimension: 0.039" L x 0.020" W (1.00mm x 0.50mm); Supplier 1: DigiKey; Supplier Part Number 1: YAG3071CT-ND; Supplier Device Package: 0402; Tolerance: ±1%
U1 = CMP-019-00049-2: Split-Rail, Single Inductor Dual Output Converter with Positive and Negative Outputs 15-DSBGA -40 to 85
U2 = CMP-019-00051-2: 6 channel high-efficiency/Efficacy LED backlight driver 20-DSBGA -30 to 85

## Sheet MainboardConn.SchDoc
size 431 x 279 mm; Organization: ORGANIZATION; Address1: ADDRESS 1; Address2: ADDRESS 2; Address3: ADDRESS 3; Address4: ADDRESS 4; Revision: -; SheetNumber: 5; SheetTotal: 5; ENG_APP_DATE: --/--/--; DSN_APP_DATE: --/--/--; CHK_APP_DATE: --/--/--
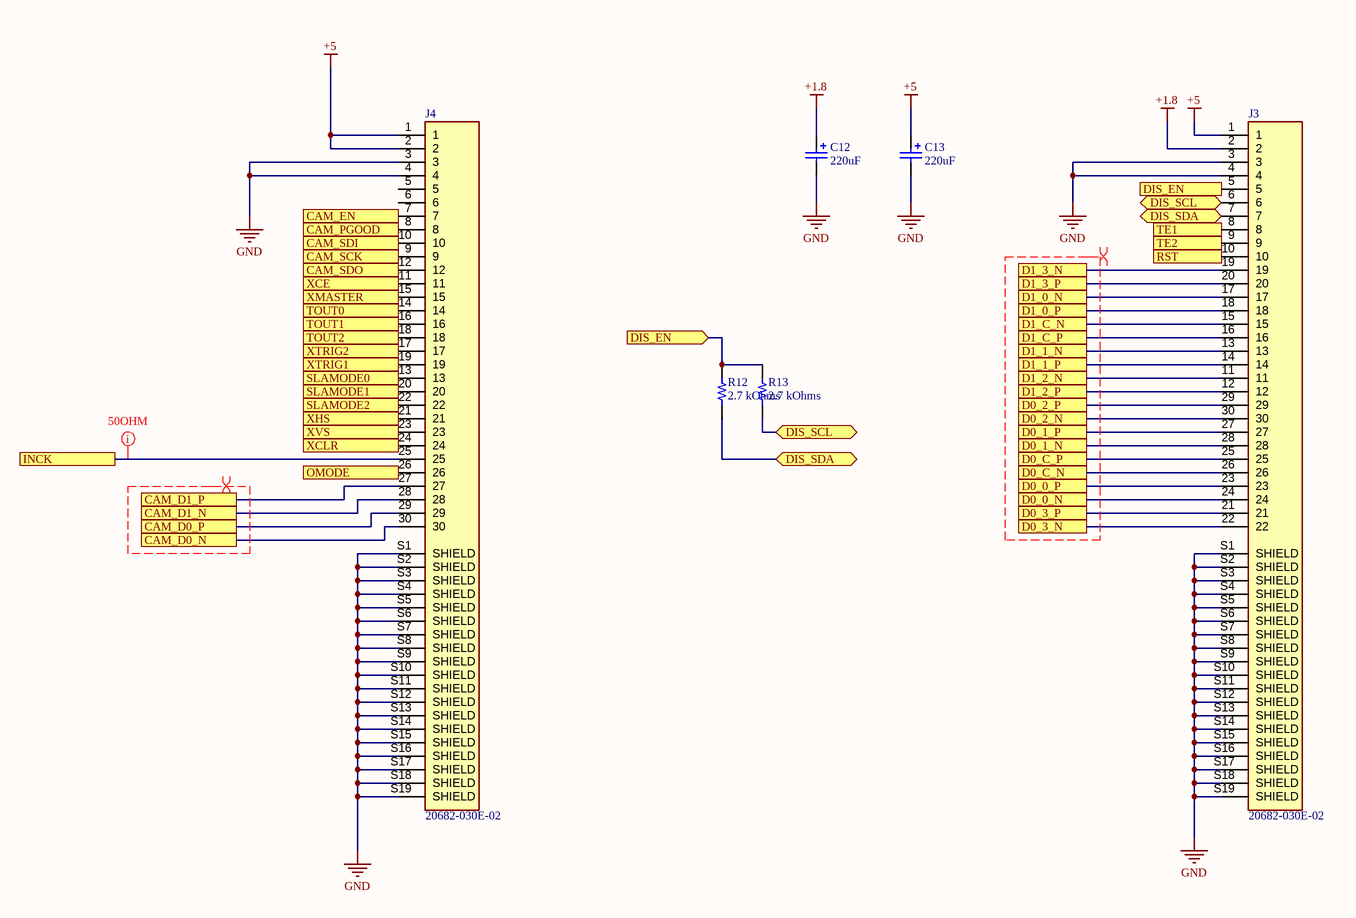
[diagram p4: MainboardConn.SchDoc]

### Parts
C12  220uF  [WCAP-PHGP_L7.3W4.3H1.9]
C13  220uF  [WCAP-PHGP_L7.3W4.3H1.9]
J3  20682-030E-02  [IPEX_20682-030E-02]
J4  20682-030E-02  [IPEX_20682-030E-02]
R12  2.7 kOhms  [RES 0201_0603]
R13  2.7 kOhms  [RES 0201_0603]

### Ports
CAM_D0_N, CAM_D0_P, CAM_D1_N, CAM_D1_P, CAM_EN, CAM_PGOOD, CAM_SCK, CAM_SDI, CAM_SDO, D0_0_N, D0_0_P, D0_1_N, D0_1_P, D0_2_N, D0_2_P, D0_3_N, D0_3_P, D0_C_N, D0_C_P, D1_0_N, D1_0_P, D1_1_N, D1_1_P, D1_2_N, D1_2_P, D1_3_N, D1_3_P, D1_C_N, D1_C_P, DIS_EN (in), DIS_SCL (bidir), DIS_SDA (bidir), INCK, OMODE, RST, SLAMODE0, SLAMODE1, SLAMODE2, TE1, TE2, TOUT0, TOUT1, TOUT2, XCE, XCLR, XHS, XMASTER, XTRIG1, XTRIG2, XVS

### Nets
+1.8: C12.1(P) J3.2
+5: C13.1(P) J3.1 J4.1 J4.2
GND: C12.2(N) C13.2(N) J3.3 J3.4 J3.S1(SHIELD) J3.S2(SHIELD) J3.S3(SHIELD) J3.S4(SHIELD) J3.S5(SHIELD) J3.S6(SHIELD) J3.S7(SHIELD) J3.S8(SHIELD) J3.S9(SHIELD) J3.S10(SHIELD) J3.S11(SHIELD) J3.S12(SHIELD) J3.S13(SHIELD) J3.S14(SHIELD) J3.S15(SHIELD) J3.S16(SHIELD) J3.S17(SHIELD) J3.S18(SHIELD) J3.S19(SHIELD) J4.3 J4.4 J4.S1(SHIELD) J4.S2(SHIELD) J4.S3(SHIELD) J4.S4(SHIELD) J4.S5(SHIELD) J4.S6(SHIELD) J4.S7(SHIELD) J4.S8(SHIELD) J4.S9(SHIELD) J4.S10(SHIELD) J4.S11(SHIELD) J4.S12(SHIELD) J4.S13(SHIELD) J4.S14(SHIELD) J4.S15(SHIELD) J4.S16(SHIELD) J4.S17(SHIELD) J4.S18(SHIELD) J4.S19(SHIELD)
CAM_D0_N: J4.30 ; port CAM_D0_N
CAM_D0_P: J4.29 ; port CAM_D0_P
CAM_D1_N: J4.28 ; port CAM_D1_N
CAM_D1_P: J4.27 ; port CAM_D1_P
CAM_EN: J4.7 ; port CAM_EN
CAM_PGOOD: J4.8 ; port CAM_PGOOD
CAM_SCK: J4.9 ; port CAM_SCK
CAM_SDI: J4.10 ; port CAM_SDI
CAM_SDO: J4.12 ; port CAM_SDO
D0_0_N: J3.24 ; port D0_0_N
D0_0_P: J3.23 ; port D0_0_P
D0_1_N: J3.28 ; port D0_1_N
D0_1_P: J3.27 ; port D0_1_P
D0_2_N: J3.30 ; port D0_2_N
D0_2_P: J3.29 ; port D0_2_P
D0_3_N: J3.22 ; port D0_3_N
D0_3_P: J3.21 ; port D0_3_P
D0_C_N: J3.26 ; port D0_C_N
D0_C_P: J3.25 ; port D0_C_P
D1_0_N: J3.17 ; port D1_0_N
D1_0_P: J3.18 ; port D1_0_P
D1_1_N: J3.13 ; port D1_1_N
D1_1_P: J3.14 ; port D1_1_P
D1_2_N: J3.11 ; port D1_2_N
D1_2_P: J3.12 ; port D1_2_P
D1_3_N: J3.19 ; port D1_3_N
D1_3_P: J3.20 ; port D1_3_P
D1_C_N: J3.15 ; port D1_C_N
D1_C_P: J3.16 ; port D1_C_P
DIS_EN: J3.5 R12.2 R13.2 ; port DIS_EN
DIS_SCL: J3.6 R13.1 ; port DIS_SCL
DIS_SDA: J3.7 R12.1 ; port DIS_SDA
INCK: J4.25 ; port INCK
OMODE: J4.26 ; port OMODE
RST: J3.10 ; port RST
SLAMODE0: J4.13 ; port SLAMODE0
SLAMODE1: J4.20 ; port SLAMODE1
SLAMODE2: J4.22 ; port SLAMODE2
TE1: J3.8 ; port TE1
TE2: J3.9 ; port TE2
TOUT0: J4.14 ; port TOUT0
TOUT1: J4.16 ; port TOUT1
TOUT2: J4.18 ; port TOUT2
XCE: J4.11 ; port XCE
XCLR: J4.24 ; port XCLR
XHS: J4.21 ; port XHS
XMASTER: J4.15 ; port XMASTER
XTRIG1: J4.19 ; port XTRIG1
XTRIG2: J4.17 ; port XTRIG2
XVS: J4.23 ; port XVS

Not connected (* = marked no-connect by the designer): J4 5 6

### Layout directives
differential pair; net class MIPI; differential pair class MIPI: (no net found under the mark)
differential pair; net class SLVS-EC; differential pair class SLVS-EC: (no net found under the mark)
net class 50OHM: INCK

### Notes on the sheet
- DWG. NO.
- REV.
- SHT.
- REVISION
- DESCRIPTION
- DATE
- APPROVED
- ENG:
- APPROVALS
- PROJECT
- DSN:
- CHK:
- REFERENCE DOCUMENTS
- PROJECT REVISION:
- TITLE
- SimulaVR
- DOCUMENT REVISION:
- DESIGN ITEM:
- BOM:
- FAB DWG:
- PCB DWG:
- ASSY DWG:
- SCALE:
- SIZE
- B
- CAGE CODE
- FILE NAME
- DWG NO.
- SHEET
- OF
- REV

### Library data of the parts
C12 C13 = 875015119006: WCAP-PHGP Aluminum Polymer Capacitor, H-Chip SMT, L7.3W4.3H1.9mm, 220uF, 6.3V; Manufacturer: Wurth Elektronik; Capacitance Tolerance: +/-20%; Dissipation Factor: 6%; Endurance: 2000h; ESR: 15mOhm; Leakage Current: 138.6uA; Ripple Current: 5100mA; Technical Reference: PSE2917221M6R3DHCT2HT19; ComponentLink1Description: Manufacturer Link; ComponentLink1URL: https://www.we-online.com/redexpert/article/875015119006?ad; ComponentLink2Description: Datasheet; ComponentLink2URL: https://www.we-online.com/redexpert/spec/875015119006?ad; Category: Aluminum Polymer Capacitors; Match Code: WCAP-PHGP; Manufacturer Part Number: 875015119006; Mount: Surface Mount; Operating Temperature Max: 105°C; Operating Temperature Min: -55°C; Packaging: Tape and Reel; Length: 7.3mm; Width: 4.3mm; Height: 1.9mm; Capacitance: 220uF; Rated Voltage (DC): 6.3V
J3 = 20682-030E-02: Cabline-CAII Rece. Ass'y; MF: {'manufacturer': u'I-PEX'}; Value: *; Availability: Unavailable; Price: None; Package: None; MP: 20682-030E-02
J4 = CMP-004-000000-1: Cabline-CAII Rece. Ass'y; MF: {'manufacturer': u'I-PEX'}; Availability: Unavailable; Price: None; MP: 20682-030E-02; Design Item ID: 20682-030E-02; Source: 20682-030E-02.SchLib; Package: None; Value: *
R12 R13 = ERJ-U01J272C: as R1 on sheet DisplayConn; Part Number: ERJ-U01J272C; Value: 2.7 kOhms; ComponentLink1Description: Datasheet; ComponentLink1URL: https://industrial.panasonic.com/cdbs/www-data/pdf/RDP0000/AOA0000C334.pdf; ComponentLink2Description: DigiKey Link; ComponentLink2URL: https://www.digikey.com/en/products/detail/panasonic-electronic-components/ERJ-U01J272C/11641374; Composition: Thick Film; Device Package: 0201 (0603 Metric); Features: Anti-Sulfur; Height - Seated (Max): 0.010" (0.26mm); LastUpdated: 2022-04-12 22:15:26; Lifecycle Status: Active; Minimum Order: 1; Number of Terminations: 2; Operating Temperature: -55°C ~ 125°C; Package / Case: 0201 (0603 Metric); Packaging: TapeAndReel; PartId: 64645; Part Status: Active; Price: 0.04; Resistance: 2.7 kOhms; Series: ERJ-U01; Size / Dimension: 0.024" L x 0.012" W (0.60mm x 0.30mm); Supplier 1: DigiKey; Supplier Part Number 1: 10-ERJ-U01J272CCT-ND; Supplier Device Package: 0201; Tolerance: ±5%

## Nets that join several sheets
+1.1: CameraConn (J1.4 J1.5 J1.6), CameraSupplies (C19.2 L3.1 R9.1)
+1.8: DisplayConn (5 pins), DisplaySupplies (C16.2 IC1.1), MainboardConn (C12.1 J3.2)
+5: CameraConn (J1.1 J1.2 J1.3), CameraSupplies (C18.2 R7.1 U3.2), DisplaySupplies (7 pins), MainboardConn (C13.1 J3.1 J4.1 J4.2)
GND: CameraConn (18 pins), CameraSupplies (8 pins), DisplayConn (17 pins), DisplaySupplies (21 pins), MainboardConn (44 pins)
CAM_D0_N: CameraConn (J1.59), MainboardConn (J4.30)
CAM_D0_P: CameraConn (J1.57), MainboardConn (J4.29)
CAM_D1_N: CameraConn (J1.54), MainboardConn (J4.28)
CAM_D1_P: CameraConn (J1.52), MainboardConn (J4.27)
CAM_EN: CameraConn (J1.9), MainboardConn (J4.7)
CAM_EN_1V1: CameraConn (J1.8), CameraSupplies (U3.10)
CAM_PGOOD: CameraConn (J1.10), MainboardConn (J4.8)
CAM_SCK: CameraConn (J1.16), MainboardConn (J4.9)
CAM_SDI: CameraConn (J1.15), MainboardConn (J4.10)
CAM_SDO: CameraConn (J1.17), MainboardConn (J4.12)
D0_0_N: DisplayConn (J2.35), MainboardConn (J3.24)
D0_0_P: DisplayConn (J2.36), MainboardConn (J3.23)
D0_1_N: DisplayConn (J2.41), MainboardConn (J3.28)
D0_1_P: DisplayConn (J2.42), MainboardConn (J3.27)
D0_2_N: DisplayConn (J2.44), MainboardConn (J3.30)
D0_2_P: DisplayConn (J2.45), MainboardConn (J3.29)
D0_3_N: DisplayConn (J2.32), MainboardConn (J3.22)
D0_3_P: DisplayConn (J2.33), MainboardConn (J3.21)
D0_C_N: DisplayConn (J2.38), MainboardConn (J3.26)
D0_C_P: DisplayConn (J2.39), MainboardConn (J3.25)
D1_0_N: DisplayConn (J2.27), MainboardConn (J3.17)
D1_0_P: DisplayConn (J2.26), MainboardConn (J3.18)
D1_1_N: DisplayConn (J2.21), MainboardConn (J3.13)
D1_1_P: DisplayConn (J2.20), MainboardConn (J3.14)
D1_2_N: DisplayConn (J2.18), MainboardConn (J3.11)
D1_2_P: DisplayConn (J2.17), MainboardConn (J3.12)
D1_3_N: DisplayConn (J2.30), MainboardConn (J3.19)
D1_3_P: DisplayConn (J2.29), MainboardConn (J3.20)
D1_C_N: DisplayConn (J2.24), MainboardConn (J3.15)
D1_C_P: DisplayConn (J2.23), MainboardConn (J3.16)
DIS_EN: DisplaySupplies (6 pins), MainboardConn (J3.5 R12.2 R13.2)
DIS_SCL: DisplaySupplies (U1.B2 U2.A4), MainboardConn (J3.6 R13.1)
DIS_SDA: DisplaySupplies (U1.C2 U2.A3), MainboardConn (J3.7 R12.1)
INCK: CameraConn (J1.35), MainboardConn (J4.25)
LED1: DisplayConn (J2.50), DisplaySupplies (U2.E1)
LED2: DisplayConn (J2.51), DisplaySupplies (U2.E2)
LED3: DisplayConn (J2.52), DisplaySupplies (U2.E3)
LED4: DisplayConn (J2.56), DisplaySupplies (U2.E4)
LED5: DisplayConn (J2.57), DisplaySupplies (U2.D4)
LED6: DisplayConn (J2.58), DisplaySupplies (U2.C4)
LED+: DisplayConn (6 pins), DisplaySupplies (C9.2 C10.2 D1.1 U2.C2)
LEDPWM: DisplayConn (J2.10), DisplaySupplies (R5.2)
OMODE: CameraConn (J1.29), MainboardConn (J4.26)
RST: DisplayConn (J2.15), MainboardConn (J3.10)
SLAMODE0: CameraConn (J1.20), MainboardConn (J4.13)
SLAMODE1: CameraConn (J1.25), MainboardConn (J4.20)
SLAMODE2: CameraConn (J1.27), MainboardConn (J4.22)
TE1: DisplayConn (J2.12), MainboardConn (J3.8)
TE2: DisplayConn (J2.11), MainboardConn (J3.9)
TOUT0: CameraConn (J1.19), MainboardConn (J4.14)
TOUT1: CameraConn (J1.21), MainboardConn (J4.16)
TOUT2: CameraConn (J1.23), MainboardConn (J4.18)
VSN: DisplayConn (J2.1 J2.2), DisplaySupplies (C7.2 U1.A2)
VSP: DisplayConn (J2.7 J2.8), DisplaySupplies (C4.2 U1.E3)
XCE: CameraConn (J1.18), MainboardConn (J4.11)
XCLR: CameraConn (J1.33), MainboardConn (J4.24)
XHS: CameraConn (J1.28), MainboardConn (J4.21)
XMASTER: CameraConn (J1.22), MainboardConn (J4.15)
XTRIG1: CameraConn (J1.26), MainboardConn (J4.19)
XTRIG2: CameraConn (J1.24), MainboardConn (J4.17)
XVS: CameraConn (J1.30), MainboardConn (J4.23)